# Altium schematic sheet Alim12_Mot.SchDoc
size A4; Author: Audran; CompanyName: Goldorak; Address1: Electrolab; Address2: 52 rue Paul Lescop; Address3: 92000 Nanterre; ProjectName: Cartes_2017
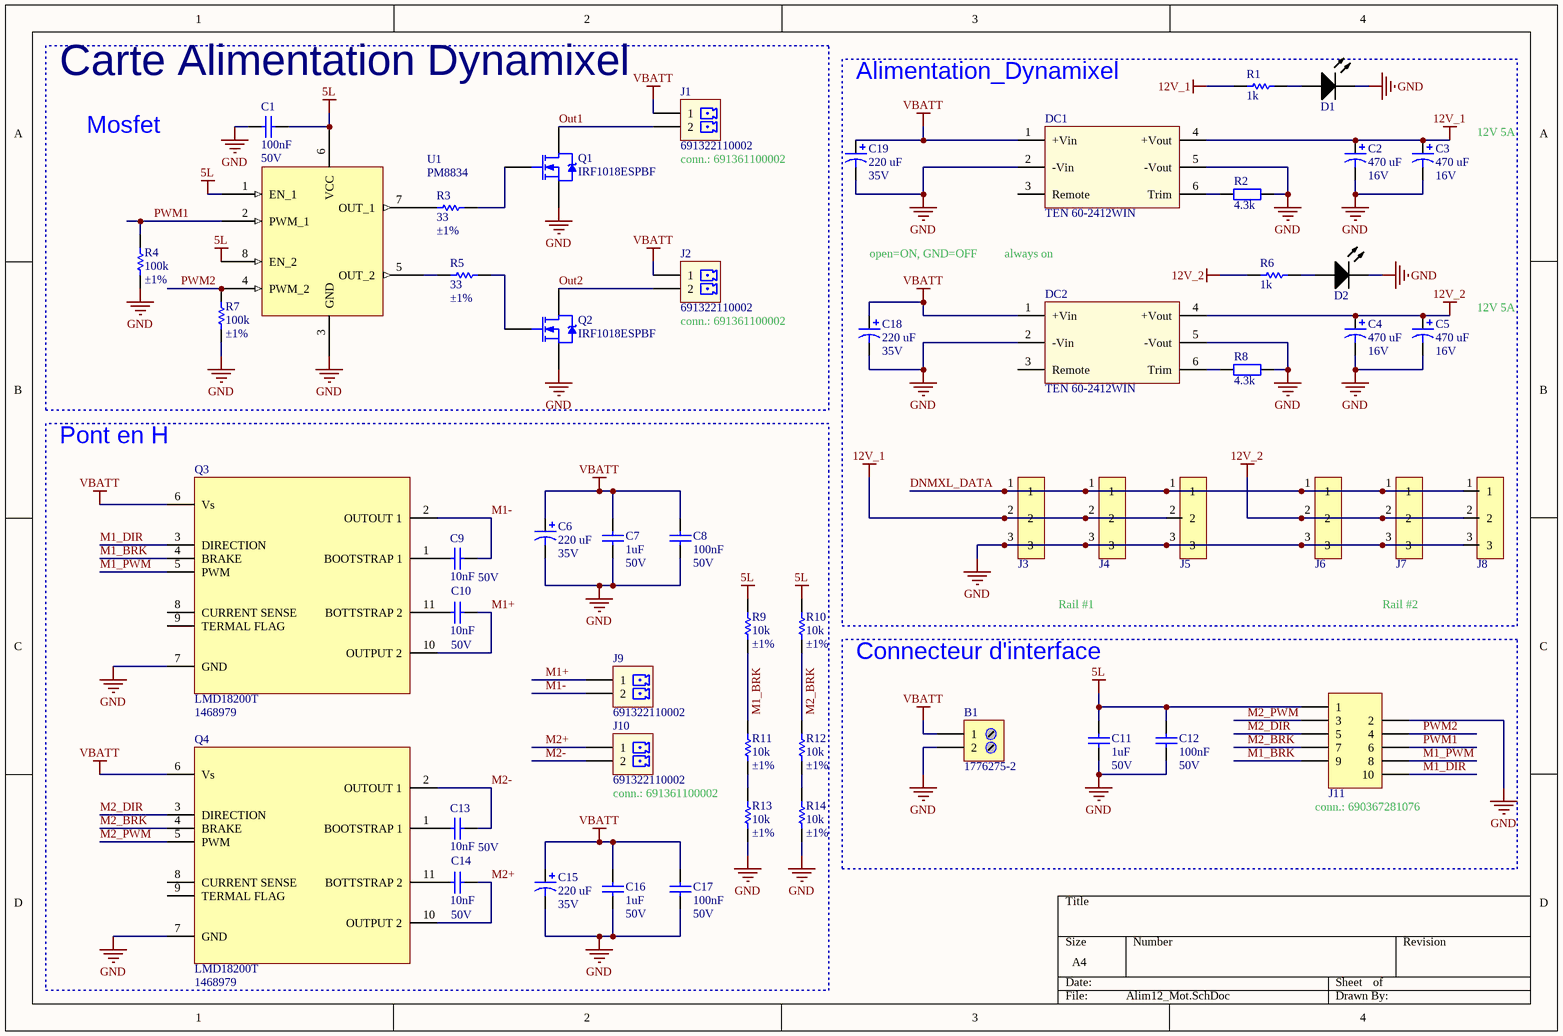
[diagram p0: Alim12_Mot.SchDoc]

## Parts
B1  1776275-2  [BORNIER_2V_3.5MM]
C1  100nF  RatedVoltage: 50V  [WCAP-CSGP_0603, 1.6x0.8x0.8]
C2  470 uF  RatedVoltage: 16V  [WCAP-ATG8_8x11.5x3.5x0.5]
C3  470 uF  RatedVoltage: 16V  [WCAP-ATG8_8x11.5x3.5x0.5]
C4  470 uF  RatedVoltage: 16V  [WCAP-ATG8_8x11.5x3.5x0.5]
C5  470 uF  RatedVoltage: 16V  [WCAP-ATG8_8x11.5x3.5x0.5]
C6  220 uF  RatedVoltage: 35V  [WCAP-ATG8_8x11.5x3.5x0.5]
C7  1uF  RatedVoltage: 50V  [WCAP-CSGP_0805, 2x1.25x1.25]
C8  100nF  RatedVoltage: 50V  [WCAP-CSGP_0603, 1.6x0.8x0.8]
C9  10nF  RatedVoltage: 50V  [WCAP-CSGP_0603, 1.6x0.8x0.8]
C10  10nF  RatedVoltage: 50V  [WCAP-CSGP_0603, 1.6x0.8x0.8]
C11  1uF  RatedVoltage: 50V  [WCAP-CSGP_0805, 2x1.25x1.25]
C12  100nF  RatedVoltage: 50V  [WCAP-CSGP_0603, 1.6x0.8x0.8]
C13  10nF  RatedVoltage: 50V  [WCAP-CSGP_0603, 1.6x0.8x0.8]
C14  10nF  RatedVoltage: 50V  [WCAP-CSGP_0603, 1.6x0.8x0.8]
C15  220 uF  RatedVoltage: 35V  [WCAP-ATG8_8x11.5x3.5x0.5]
C16  1uF  RatedVoltage: 50V  [WCAP-CSGP_0805, 2x1.25x1.25]
C17  100nF  RatedVoltage: 50V  [WCAP-CSGP_0603, 1.6x0.8x0.8]
C18  220 uF  RatedVoltage: 35V  [WCAP-ATG8_8x11.5x3.5x0.5]
C19  220 uF  RatedVoltage: 35V  [WCAP-ATG8_8x11.5x3.5x0.5]
D1  LED  [LED_3MM]  (value not drawn)
D2  LED  [LED_3MM]  (value not drawn)
DC1  TEN 60-2412WIN  [TEN 60]  (no BOM)
DC2  TEN 60-2412WIN  [TEN 60]  (no BOM)
J1  691322110002  [691322110002]
J2  691322110002  [691322110002]
J3  22-03-5035  [20-03-5035]  (value not drawn)
J4  22-03-5035  [20-03-5035]  (value not drawn)
J5  22-03-5035  [20-03-5035]  (value not drawn)
J6  22-03-5035  [20-03-5035]  (value not drawn)
J7  22-03-5035  [20-03-5035]  (value not drawn)
J8  22-03-5035  [20-03-5035]  (value not drawn)
J9  691322110002  [691322110002]
J10  691322110002  [691322110002]
J11  (no value)  [690367281076]
Q1  IRF1018ESPBF  [D2Pak / AAVID 7109DG]
Q2  IRF1018ESPBF  [D2Pak / AAVID 7109DG]
Q3  LMD18200T  Supplier Part Number 1: 1468979  [LMD18200T]
Q4  LMD18200T  Supplier Part Number 1: 1468979  [LMD18200T]
R1  value 1k  [RESC1608X06N]  (hidden comment: RC0603FR-071KL)
R2  4.3k  [RESC2012X06M]
R3  value 33  Precision: ±1%  [RESC1608X06N]  (hidden comment: RC0603FR-0733RL)
R4  value 100k  Precision: ±1%  [RESC1608X06N]  (hidden comment: RC0603FR-07100KL)
R5  value 33  Precision: ±1%  [RESC1608X06N]  (hidden comment: RC0603FR-0733RL)
R6  value 1k  [RESC1608X06N]  (hidden comment: RC0603FR-071KL)
R7  value 100k  Precision: ±1%  [RESC1608X06N]  (hidden comment: RC0603FR-07100KL)
R8  4.3k  [RESC2012X06M]
R9  value 10k  Precision: ±1%  [RESC1608X06N]  (hidden comment: RC0603FR-0710KL)
R10  value 10k  Precision: ±1%  [RESC1608X06N]  (hidden comment: RC0603FR-0710KL)
R11  value 10k  Precision: ±1%  [RESC1608X06N]  (hidden comment: RC0603FR-0710KL)
R12  value 10k  Precision: ±1%  [RESC1608X06N]  (hidden comment: RC0603FR-0710KL)
R13  value 10k  Precision: ±1%  [RESC1608X06N]  (hidden comment: RC0603FR-0710KL)
R14  value 10k  Precision: ±1%  [RESC1608X06N]  (hidden comment: RC0603FR-0710KL)
U1  PM8834  [SOIC127P600X175-8N]

## Blocks framed on the sheet
Carte Alimentation Dynamixel: C1 J1 J2 Q1 Q2 R3-R5 R7 U1
Alimentation_Dynamixel: C2-C5 C18 C19 D1 D2 DC1 DC2 J3-J8 R1 R2 R6 R8
Pont en H: C6-C10 C13-C17 J9 J10 Q3 Q4 R9-R14
Connecteur d'interface: B1 C11 C12 J11

## Nets
5L: C1.2 C11.2 C12.2 J11.1 R9.2 R10.2 U1.1(EN_1) U1.6(VCC) U1.8(EN_2)
12V_1: C2.1 C3.1 DC1.4(+Vout) J3.2 J4.2 J5.2 R1.1
12V_2: C4.1 C5.1 DC2.4(+Vout) J6.2 J7.2 J8.2 R6.1
GND: B1.2 C1.1 C2.2 C3.2 C4.2 C5.2 C6.2 C7.1 C8.1 C11.1 C12.1 C15.2 C16.1 C17.1 C18.2 C19.2 D1.2(C) D2.2(C) DC1.2(-Vin) DC1.5(-Vout) DC2.2(-Vin) DC2.5(-Vout) J3.3 J4.3 J5.3 J6.3 J7.3 J8.3 J11.2 Q1.3(S) Q2.3(S) Q3.7(GND) Q4.7(GND) R2.1 R4.1 R7.1 R8.1 R13.1 R14.1 U1.3(GND)
VBATT: B1.1 C6.1 C7.2 C8.2 C15.1 C16.2 C17.2 C18.1 C19.1 DC1.1(+Vin) DC2.1(+Vin) J1.1 J2.1 Q3.6(Vs) Q4.6(Vs)
DNMXL_DATA: J3.1 J4.1 J5.1 J6.1 J7.1 J8.1
M1+: C10.2 J9.1 Q3.10(OUTPUT_2)
M1-: C9.2 J9.2 Q3.2(OUTOUT_1)
M1_BRK: J11.9 Q3.4(BRAKE) R9.1 R11.2
M1_DIR: J11.10 Q3.3(DIRECTION)
M1_PWM: J11.8 Q3.5(PWM)
M2+: C14.2 J10.1 Q4.10(OUTPUT_2)
M2-: C13.2 J10.2 Q4.2(OUTOUT_1)
M2_BRK: J11.7 Q4.4(BRAKE) R10.1 R12.2
M2_DIR: J11.5 Q4.3(DIRECTION)
M2_PWM: J11.3 Q4.5(PWM)
Out1: J1.2 Q1.2(D)
Out2: J2.2 Q2.2(D)
PWM1: J11.6 R4.2 U1.2(PWM_1)
PWM2: J11.4 R7.2 U1.4(PWM_2)
NetC9_1: C9.1 Q3.1(BOOTSTRAP_1)
NetC10_1: C10.1 Q3.11(BOTTSTRAP_2)
NetC13_1: C13.1 Q4.1(BOOTSTRAP_1)
NetC14_1: C14.1 Q4.11(BOTTSTRAP_2)
NetD1_1: D1.1(A) R1.2
NetD2_1: D2.1(A) R6.2
NetDC1_6: DC1.6(Trim) R2.2
NetDC2_6: DC2.6(Trim) R8.2
NetQ1_1: Q1.1(G) R3.2
NetQ2_1: Q2.1(G) R5.2
NetR3_1: R3.1 U1.7(OUT_1)
NetR5_1: R5.1 U1.5(OUT_2)
NetR11_1: R11.1 R13.2
NetR12_1: R12.1 R14.2

Not connected (* = marked no-connect by the designer): DC1 3(Remote); DC2 3(Remote); Q3 8(CURRENT_SENSE) 9(TERMAL_FLAG); Q4 8(CURRENT_SENSE) 9(TERMAL_FLAG)

## Notes on the sheet
- Mosfet
- (near J1) conn.: 691361100002
- 12V 5A
- open=ON, GND=OFF
- always on
- (near J2) conn.: 691361100002
- Rail #1
- Rail #2
- conn.: 691361100002
- (near J11) conn.: 690367281076

## Library data of the parts
B1 = 1776275-2: TERM BLOCK 2POS SIDE ENT 3.5MM; Manufacturer: TE Connectivity AMP Connectors; Supplier 1: Farnell; Supplier Part Number 1: 1098611; Manufacturer Part Number: 1776275-2; ComponentLink1URL: http://www.te.com/commerce/DocumentDelivery/DDEController?Action=srchrtrv&DocNm=1776275&DocType=Customer+Drawing&DocLang=English; ComponentLink1Description: http://www.te.com/commerce/DocumentDelivery/DDEController?Action=srchrtrv&DocNm=1776275&DocType=Customer+Drawing&DocLang=English
C1 C8 C12 C17 = WCAP-CSGP, 885012206095: CAP CER 100nF 50V X7R 0603; Manufacturer: Wurth Elektronik; PublishedDate: Aug 2016; ComponentLink1Description: Manufacturer; ComponentLink1URL: http://www.we-online.de; ComponentLink2Description: Datasheet; ComponentLink2URL: http://katalog.we-online.com/pbs/datasheet/885012206095.pdf; Manufacturer Part Number: 885012206095; Value: 100nF; Size: 0603; CeramicType: X7R
C2-C5 = WCAP-ATG8, 860010374012: CAP Alu 470 UF 20% 16 V; Manufacturer: Wurth Elektronik; PublishedDate: July 2016; ComponentLink1Description: Manufacturer; ComponentLink1URL: http://www.we-online.de; ComponentLink2Description: Datasheet; ComponentLink2URL: http://katalog.we-online.de/pbs/datasheet/860010374012.pdf; Manufacturer Part Number: 860010374012; Value: 470 uF; Size: 8mmx11.5mm
C6 C15 C18 C19 = WCAP-ATG8, 860010574011: CAP Alu 220 UF 20% 35 V; Manufacturer: Wurth Elektronik; PublishedDate: July 2016; ComponentLink1Description: Manufacturer; ComponentLink1URL: http://www.we-online.de; ComponentLink2Description: Datasheet; ComponentLink2URL: http://katalog.we-online.de/pbs/datasheet/860010574011.pdf; Manufacturer Part Number: 860010574011; Value: 220 uF; Size: 8mmx11.5mm
C7 C11 C16 = WCAP-CSGP, 885012207103: CAP CER 1uF 50V X7R 0805; Manufacturer: Wurth Elektronik; PublishedDate: Aug 2016; ComponentLink1Description: Manufacturer; ComponentLink1URL: http://www.we-online.de; ComponentLink2Description: Datasheet; ComponentLink2URL: http://katalog.we-online.com/pbs/datasheet/885012207103.pdf; Manufacturer Part Number: 885012207103; Value: 1uF; Size: 0805; CeramicType: X7R
C9 C10 C13 C14 = WCAP-CSGP, 885012206089: CAP CER 10nF 50V X7R 0603; Manufacturer: Wurth Elektronik; PublishedDate: Aug 2016; ComponentLink1Description: Manufacturer; ComponentLink1URL: http://www.we-online.de; ComponentLink2Description: Datasheet; ComponentLink2URL: http://katalog.we-online.com/pbs/datasheet/885012206089.pdf; Manufacturer Part Number: 885012206089; Value: 10nF; Size: 0603; CeramicType: X7R
D1 D2 = LED: LED 3mm - generique
DC1 DC2 = TEN 60-2412WIN: Traco 12.0V 60W 5A; Manufacturer: TRACOPOWER; Manufacturer Part Number: TEN 60-2412WIN; Pricing: 1=65.7, 5=63.73, 10=61.82, 25=59.97 (EUR); ComponentLink1URL: http://www.farnell.com/datasheets/2200542.pdf; ComponentLink1Description: http://www.farnell.com/datasheets/2200542.pdf; Supplier 1: Farnell; Supplier Part Number 1: 2451635
J1 J2 J9 J10 = 691322110002: TERM BLOCK HDR 2POS 90DEG 3.5MM; Manufacturer: Wurth Electronics Inc.; Supplier 1: Farnell; Manufacturer Part Number: 691322110002; ComponentLink1URL: http://katalog.we-online.de/em/datasheet/6913221100xx.pdf; ComponentLink1Description: Datasheet; Supplier Part Number 1: 1841315
J3-J8 = 20-03-5035: Manufacturer 1: MOLEX; Supplier 1: Farnell; Supplier Part Number 1: 9979620; Manufacturer Part Number: 22-03-5035; Pricing: 10=0.153, 100=0.144, 250=0.118, 500=0.091, 1000=0.059, 2500=0.057, 2500=0.0441, 30000=0.0397 (EUR); ComponentLink1URL: http://www.farnell.com/cad/495071.pdf; ComponentLink1Description: http://www.farnell.com/cad/495071.pdf; ComponentLink2URL: http://www.farnell.com/datasheets/1801024.pdf; ComponentLink2Description: http://www.farnell.com/datasheets/1801024.pdf; ComponentLink3Description: http://fr.farnell.com/jsp/level5/module.jsp?moduleId=fr/418942.xml; ComponentLink3URL: http://fr.farnell.com/jsp/level5/module.jsp?moduleId=fr/418942.xml
J11 = 690367281076: WR-MM Female SMT Connector with Polarization; Manufacturer 1: W¨¹rth Elektronik eiSos GmbH; ComponentLink1 Description: Manufacturer; ComponentLink2 Description: Datasheet; Value: 10; Manufacturer Part Number: 690367281076; ComponentLink1URL: http://www.we-online.com; ComponentLink2URL: http://katalog.we-online.de/em/datasheet/69036728xx76.pdf; Supplier 1: Farnell; Supplier Part Number 1: 1641851
Q1 Q2 = IRF1018ESPBF: MOSFET N-CH 60V 79A D2PAK; Manufacturer: Infineon Technologies; Supplier 1: Farnell; Supplier Part Number 1: 1602225; Manufacturer Part Number: IRF1018ESPBF; ComponentLink1URL: http://www.irf.com/product-info/datasheets/data/irf1018epbf.pdf; ComponentLink1Description: Datasheet
Q3 Q4 = LMD18200T: Manufacturer Part Number: LMD18200T/NOPB; Manufacturer: TEXAS INSTRUMENTS; Supplier 1: Farnell
R1 R6 = RC0603FR-071KL: RES SMD 1K OHM 1% 1/10W 0603; Manufacturer: Yageo; Power: 100mW; Vmax: 50V; Manufacturer Part Number: RC0603FR-071KL; Type: Thick Film; ComponentLink1Description: Manufacturer; ComponentLink1URL: http://www.yageo.com/NewPortal/_en/index.jsp; ComponentLink2Description: Datasheet; ComponentLink2URL: http://www.farnell.com/datasheets/2167052.pdf; Precision: ±1%; Supplier 1: Farnell; Supplier Part Number 1: 9238484
R2 R8 = any: RESISTOR; Manufacturer: VISHAY DRALORIC; Manufacturer Part Number: CRCW08054K30FKEA; Supplier 1: Farnell; Supplier Part Number 1: 2138959; Pricing: 50=0,008, 250=0,007, 500=0,005, 1000=0,004 (EUR); ComponentLink1URL: http://www.farnell.com/datasheets/1697337.pdf; ComponentLink1Description: http://www.farnell.com/datasheets/1697337.pdf
R3 R5 = RC0603FR-0733RL: RES SMD 33 OHM 1% 1/10W 0603; Manufacturer: Yageo; Power: 100mW; Vmax: 50V; Manufacturer Part Number: RC0603FR-0733RL; Type: Thick Film; ComponentLink1Description: Manufacturer; ComponentLink1URL: http://www.yageo.com/NewPortal/_en/index.jsp; ComponentLink2Description: Datasheet; ComponentLink2URL: http://www.farnell.com/datasheets/2167052.pdf; Supplier 1: Farnell; Supplier Part Number 1: 9238301
R4 R7 = RC0603FR-07100KL: RES SMD 100K OHM 1% 1/10W 0603; Manufacturer: Yageo; Power: 100mW; Vmax: 50V; Manufacturer Part Number: RC0603FR-07100KL; Type: Thick Film; ComponentLink1Description: Manufacturer; ComponentLink1URL: http://www.yageo.com/NewPortal/_en/index.jsp; ComponentLink2Description: Datasheet; ComponentLink2URL: http://www.farnell.com/datasheets/2167052.pdf; Supplier 1: Farnell; Supplier Part Number 1: 2309107
R9-R14 = RC0603FR-0710KL: RES SMD 10K OHM 1% 1/10W 0603; Manufacturer: Yageo; Power: 100mW; Vmax: 50V; Manufacturer Part Number: RC0603FR-0710KL; Type: Thick Film; ComponentLink1Description: Manufacturer; ComponentLink1URL: http://www.yageo.com/NewPortal/_en/index.jsp; ComponentLink2Description: Datasheet; ComponentLink2URL: http://www.farnell.com/datasheets/2167052.pdf; Supplier 1: Farnell; Supplier Part Number 1: 9238603
U1 = PM8834: IC MOSFET DVR 4A DUAL 8SOIC; Manufacturer: STMicroelectronics; ComponentLink1URL: http://www.st.com/content/ccc/resource/technical/document/datasheet/9a/22/3e/55/d3/f8/46/d5/CD00212712.pdf/files/CD00212712.pdf/jcr:content/translations/en.CD00212712.pdf; ComponentLink1Description: Datasheet; Manufacturer Part Number: PM8834; Supplier 1: Digi-Key; Supplier Part Number 1: PM8834-ND